# EAGLE design dip28-tqfp32_mega8 (EAGLE 6.3)
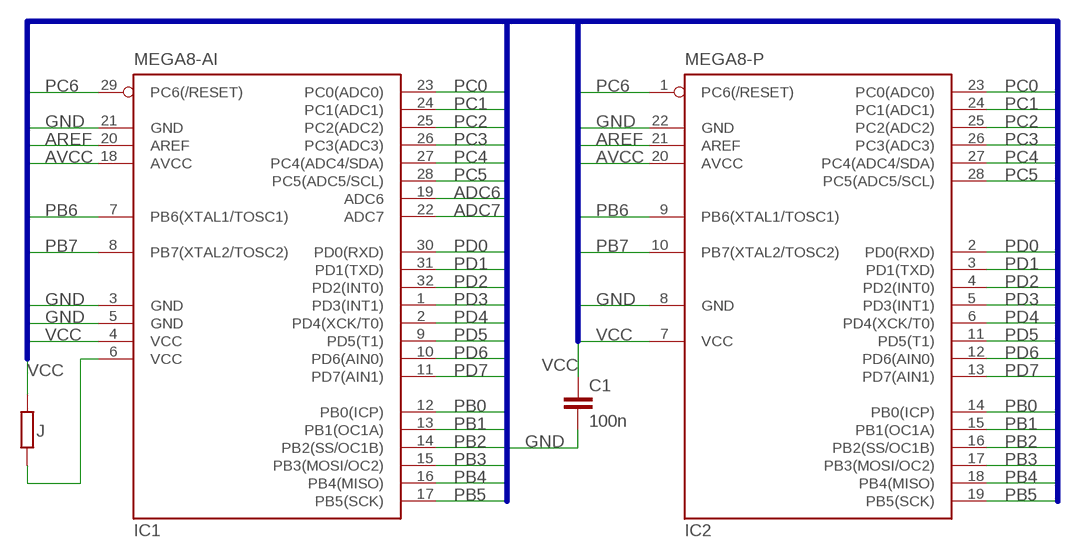
[diagram p0: schematic, sheet 1]

## Parts
C1  100n  C-EUC0805  [C0805]
IC1  MEGA8-AI  [TQFP32-08]
IC2  MEGA8-P  [DIL28-3]
J  R-EU_R1206W  [R1206W]

## Nets
ADC6: IC1.19(ADC6)
ADC7: IC1.22(ADC7)
AREF: IC1.20(AREF) IC2.21(AREF)
AVCC: IC1.18(AVCC) IC2.20(AVCC)
GND: C1.2 IC1.3(GND) IC1.5(GND) IC1.21(GND) IC2.8(GND) IC2.22(GND)
N$1: IC1.6(VCC) J.1
PB0: IC1.12(PB0(ICP)) IC2.14(PB0(ICP))
PB1: IC1.13(PB1(OC1A)) IC2.15(PB1(OC1A))
PB2: IC1.14(PB2(SS/OC1B)) IC2.16(PB2(SS/OC1B))
PB3: IC1.15(PB3(MOSI/OC2)) IC2.17(PB3(MOSI/OC2))
PB4: IC1.16(PB4(MISO)) IC2.18(PB4(MISO))
PB5: IC1.17(PB5(SCK)) IC2.19(PB5(SCK))
PB6: IC1.7(PB6(XTAL1/TOSC1)) IC2.9(PB6(XTAL1/TOSC1))
PB7: IC1.8(PB7(XTAL2/TOSC2)) IC2.10(PB7(XTAL2/TOSC2))
PC0: IC1.23(PC0(ADC0)) IC2.23(PC0(ADC0))
PC1: IC1.24(PC1(ADC1)) IC2.24(PC1(ADC1))
PC2: IC1.25(PC2(ADC2)) IC2.25(PC2(ADC2))
PC3: IC1.26(PC3(ADC3)) IC2.26(PC3(ADC3))
PC4: IC1.27(PC4(ADC4/SDA)) IC2.27(PC4(ADC4/SDA))
PC5: IC1.28(PC5(ADC5/SCL)) IC2.28(PC5(ADC5/SCL))
PC6: IC1.29(PC6(/RESET)) IC2.1(PC6(/RESET))
PD0: IC1.30(PD0(RXD)) IC2.2(PD0(RXD))
PD1: IC1.31(PD1(TXD)) IC2.3(PD1(TXD))
PD2: IC1.32(PD2(INT0)) IC2.4(PD2(INT0))
PD3: IC1.1(PD3(INT1)) IC2.5(PD3(INT1))
PD4: IC1.2(PD4(XCK/T0)) IC2.6(PD4(XCK/T0))
PD5: IC1.9(PD5(T1)) IC2.11(PD5(T1))
PD6: IC1.10(PD6(AIN0)) IC2.12(PD6(AIN0))
PD7: IC1.11(PD7(AIN1)) IC2.13(PD7(AIN1))
VCC: C1.1 IC1.4(VCC) IC2.7(VCC) J.2

## Buses
PC[0..6],ADC[6..7],PD[0..7],PB[0..7],GND,AREF,VCC,AVCC

## Library data of the parts
C1 = rcl:C-EU: CAPACITOR, European symbol
IC1 = atmel:MEGA8: MICROCONTROLLER 8 Kbytes FLASH, 1 kbytes SRAM, 512 bytes EEPROM, USART, 6-channel 10 bit ADC, 2-channel 8 bit ADC Pin compatible with Atmega48, ATMega88, ATMega168 Source: avr.lbr; MPN: ATMEGA8-16AU; OC_FARNELL: 9171371; OC_NEWARK: 73M8863
IC2 = atmel:MEGA8-P: MICROCONTROLLER 8 Kbytes FLASH, 1 kbytes SRAM, 512 bytes EEPROM, USART, 4-channel 10 bit ADC, 2-channel 8 bit ADC Pin compatible with Atmega48, ATMega88, ATMega168 Source: avr.lbr; OC_FARNELL: unknown; OC_NEWARK: unknown
J = rcl:R-EU_: RESISTOR, European symbol

## Board
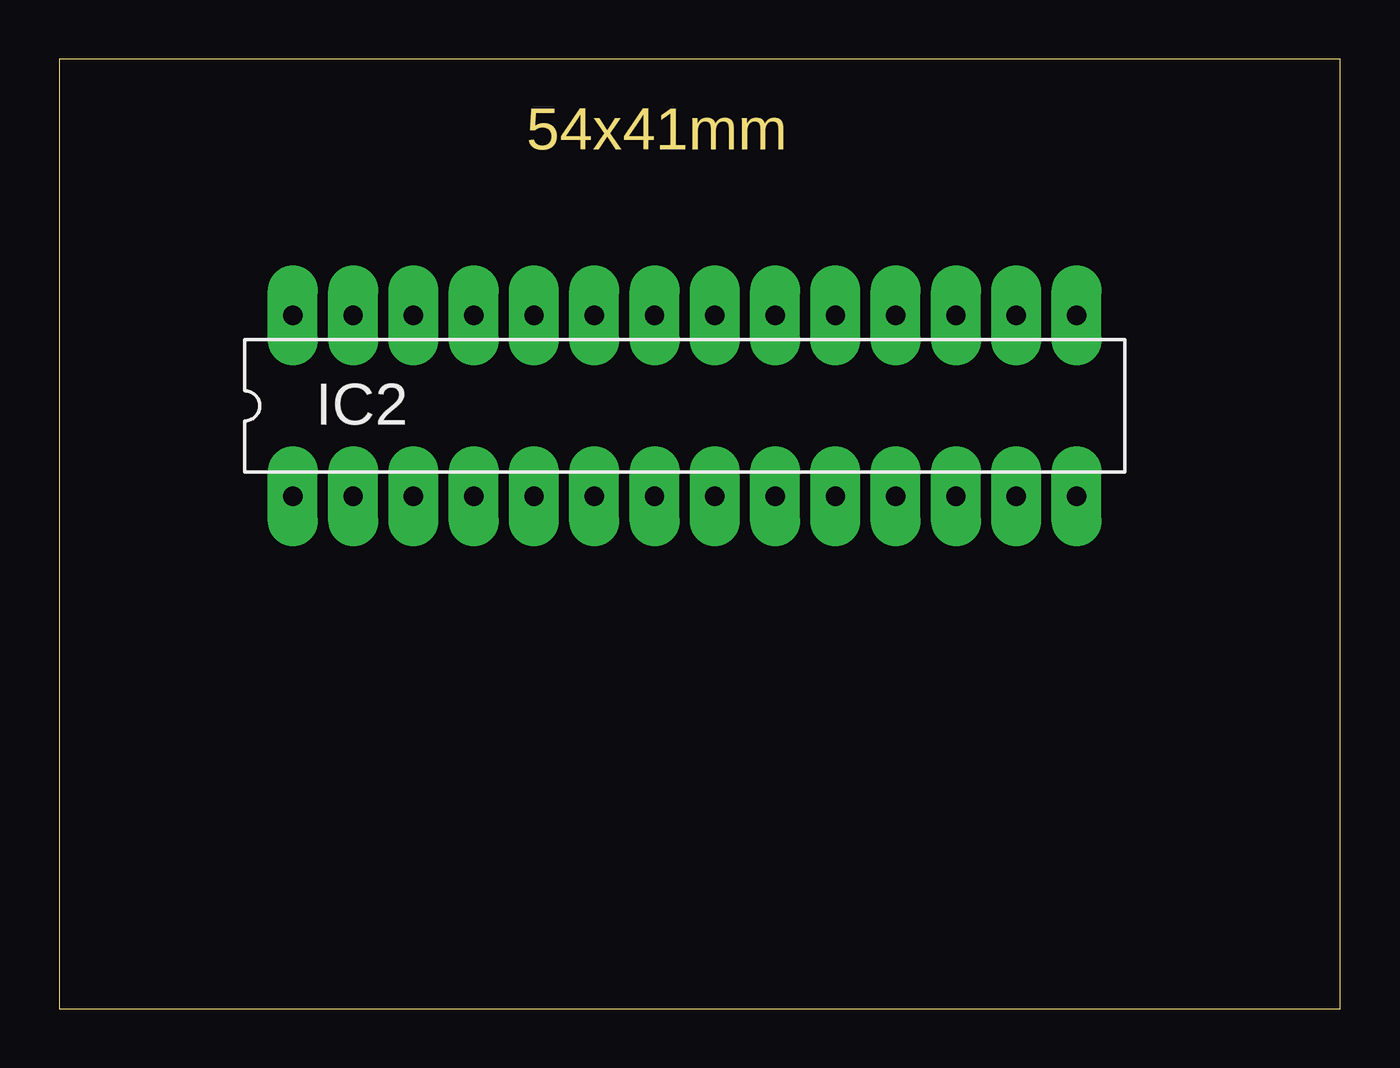
[diagram p1: board, top side]
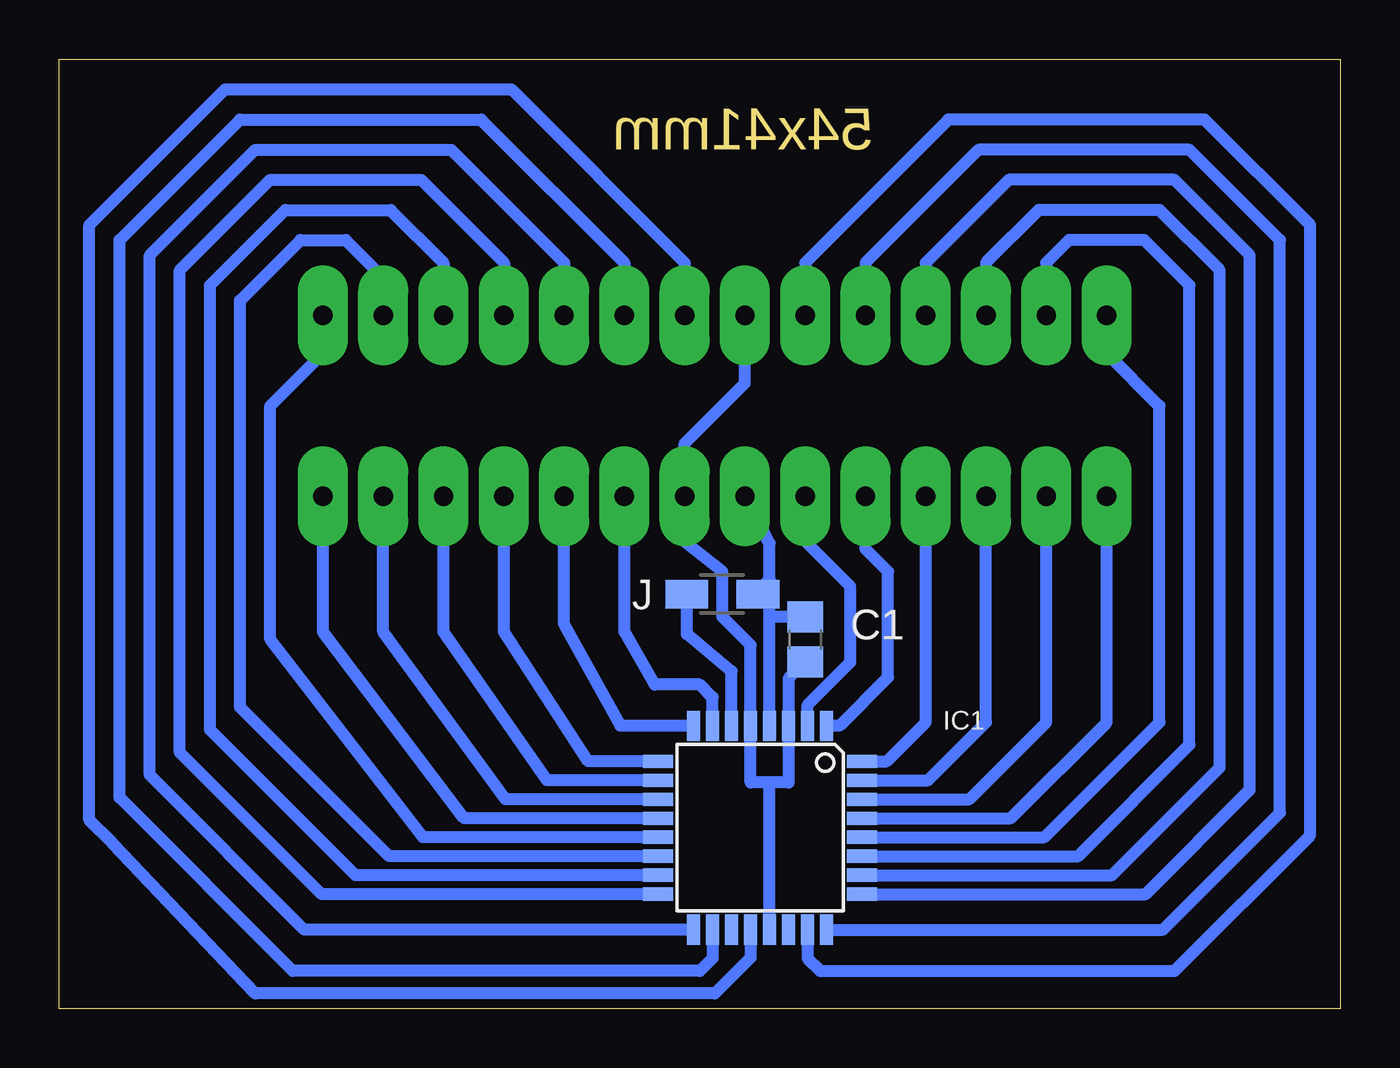
[diagram p2: board, bottom side, seen from below]

Size 53.98 x 40.01 mm. Coordinates in mm from the lower left corner, seen from the top.
Outline: 0,0 53.98,0 53.98,40.01 0,40.01 0,0
Copper layers (1*16): Top 0.035mm / dielectric 1.5mm / Bottom 0.035mm
Design rules "DesignRules": minimum track width 8mil, minimum drill 24mil, track to track 0.2mm, track to pad 0.2mm, pad to pad 8mil, via to via 8mil, smd to smd 8mil, copper to edge 10mil, drill to drill 8mil, minimum pad ring 0.65mm, minimum via ring 8mil, stop-mask expansion 4mil, vias tented up to drill 0mil, thermal gap 10mil

### Footprints (pad centres in the part's own frame; a part is rotated, then mirrored left to right if it is on the bottom)
C0805 = smd 1.3 x 1.5: 1 -0.95,0; 2 0.95,0
TQFP32-08 = smd 1.27 x 0.559: 1 -4.293,2.8; 2 -4.293,2; 3 -4.293,1.2; 4 -4.293,0.4; 5 -4.293,-0.4; 6 -4.293,-1.2; 7 -4.293,-2; 8 -4.293,-2.8; 17 4.293,-2.8; 18 4.293,-2; 19 4.293,-1.2; 20 4.293,-0.4; 21 4.293,0.4; 22 4.293,1.2; 23 4.293,2; 24 4.293,2.8 | smd 0.559 x 1.27: 9 -2.8,-4.293; 10 -2,-4.293; 11 -1.2,-4.293; 12 -0.4,-4.293; 13 0.4,-4.293; 14 1.2,-4.293; 15 2,-4.293; 16 2.8,-4.293; 25 2.8,4.293; 26 2,4.293; 27 1.2,4.293; 28 0.4,4.293; 29 -0.4,4.293; 30 -1.2,4.293; 31 -2,4.293; 32 -2.8,4.293
DIL28-3 = drill 0.813 long: 1 -16.51,-3.81; 2 -13.97,-3.81; 3 -11.43,-3.81; 4 -8.89,-3.81; 5 -6.35,-3.81; 6 -3.81,-3.81; 7 -1.27,-3.81; 8 1.27,-3.81; 9 3.81,-3.81; 10 6.35,-3.81; 11 8.89,-3.81; 12 11.43,-3.81; 13 13.97,-3.81; 14 16.51,-3.81; 15 16.51,3.81; 16 13.97,3.81; 17 11.43,3.81; 18 8.89,3.81; 19 6.35,3.81; 20 3.81,3.81; 21 1.27,3.81; 22 -1.27,3.81; 23 -3.81,3.81; 24 -6.35,3.81; 25 -8.89,3.81; 26 -11.43,3.81; 27 -13.97,3.81; 28 -16.51,3.81
R1206W = smd 1.8 x 1.2: 1 -1.499,0; 2 1.499,0

### Placement (x,y rotation side)
C1  22.54,15.56 270 bottom
IC1  24.45,7.62 270 bottom
IC2  26.35,25.4 0 top
J  26.04,17.46 0 bottom

### Tracks (layer width: path | path; a pad name or v marks a point on that pad's centre or on a via)
AREF
  Bottom 0.5: IC1.20 24.85,2.14 26.35,0.64 45.72,0.64 51.75,6.99 52.7,7.94 52.7,33.02 46.99,38.73 34.92,38.73 27.62,31.43 IC2.21
AVCC
  Bottom 0.5: IC1.18 26.45,2.13 26.99,1.59 44.13,1.59 51.44,8.89 51.44,32.38 46.35,37.47 36.2,37.47 30.16,31.43 IC2.20
GND
  Bottom 0.5: 24.13,9.53 23.25,9.53 IC1.3 23.25,13.9 C1.2 | 24.13,9.53 24.85,9.53 IC1.5 24.85,15.32 26.04,16.51 26.04,18.41 27.62,19.68 IC2.8 27.62,23.81 25.08,26.35 IC2.22 | IC1.21 24.05,9.44 24.13,9.53
N$1
  Bottom 0.5: IC1.6 25.65,14.22 27.53,15.79 J.1
PB0
  Bottom 0.5: IC1.12 36.91,8.02 42.86,15.88 IC2.14
PB1
  Bottom 0.5: IC1.13 38.65,7.22 45.09,15.56 45.09,25.4 42.86,27.62 IC2.15
PB2
  Bottom 0.5: IC1.14 40.08,6.42 46.35,12.7 46.35,29.84 43.81,32.38 41.91,32.38 40.32,30.8 IC2.16
PB3
  Bottom 0.5: IC1.15 41.5,5.62 47.62,11.75 47.62,30.48 44.45,33.66 40.01,33.66 37.78,31.43 IC2.17
PB4
  Bottom 0.5: IC1.16 42.92,4.82 48.9,10.79 48.9,31.11 45.09,34.92 38.73,34.92 35.24,31.43 IC2.18
PB5
  Bottom 0.5: IC1.17 43.65,3.33 50.16,9.84 50.16,31.75 45.72,36.2 37.47,36.2 32.7,31.43 IC2.19
PB6
  Bottom 0.5: IC1.7 26.45,13.11 26.99,13.65 28.89,13.65 30.16,15.88 IC2.9
PB7
  Bottom 0.5: IC1.8 30.33,11.91 32.7,16.19 IC2.10
PC0
  Bottom 0.5: IC1.23 22.45,2.13 21.91,1.59 6.99,1.59 1.27,7.3 1.27,33.02 5.71,37.47 16.51,37.47 22.54,31.43 IC2.23
PC1
  Bottom 0.5: IC1.24 7.47,3.33 2.54,8.26 2.54,32.38 6.35,36.2 15.24,36.2 20,31.43 IC2.24
PC2
  Bottom 0.5: IC1.25 8.2,4.82 3.81,9.21 3.81,31.75 6.99,34.92 13.97,34.92 17.46,31.43 IC2.25
PC3
  Bottom 0.5: IC1.26 9.62,5.62 5.08,10.16 5.08,31.11 7.62,33.66 12.7,33.66 14.92,31.43 IC2.26
PC4
  Bottom 0.5: IC1.27 11.04,6.42 6.35,11.11 6.35,30.48 8.26,32.38 11.43,32.38 12.38,31.43 IC2.27
PC5
  Bottom 0.5: IC1.28 12.46,7.22 7.62,12.06 7.62,25.4 9.84,27.62 IC2.28
PC6
  Bottom 0.5: IC1.29 13.89,8.02 9.84,12.06 IC2.1
PD0
  Bottom 0.5: IC1.30 15.63,8.82 12.38,12.06 IC2.2
PD1
  Bottom 0.5: IC1.31 17.37,9.62 14.92,12.06 IC2.3
PD2
  Bottom 0.5: IC1.32 19.11,10.42 17.46,12.06 IC2.4
PD3
  Bottom 0.5: IC1.1 21.11,11.91 19.05,13.97 19.05,18.41 20,19.37 IC2.5
PD4
  Bottom 0.5: 22.45,21.5 IC2.6 22.54,19.68 20.64,17.78 20.64,14.61 22.45,12.79 IC1.2
PD5
  Bottom 0.5: IC1.9 31.69,10.42 35.24,15.88 IC2.11
PD6
  Bottom 0.5: IC1.10 33.43,9.62 37.78,15.88 IC2.12
PD7
  Bottom 0.5: IC1.11 35.17,8.82 40.32,15.88 IC2.13
VCC
  Bottom 0.5: IC1.4 24.05,16.51 | 24.05,16.51 24.05,18.1 | 24.05,18.1 24.05,19.6 IC2.7 | C1.1 24.05,16.51 | J.2 24.05,18.1

### Text on the board
Dimension: 54x41mm